# EAGLE schematic 4AC to 3.6DC (0 Cost) (EAGLE 9.6.2)
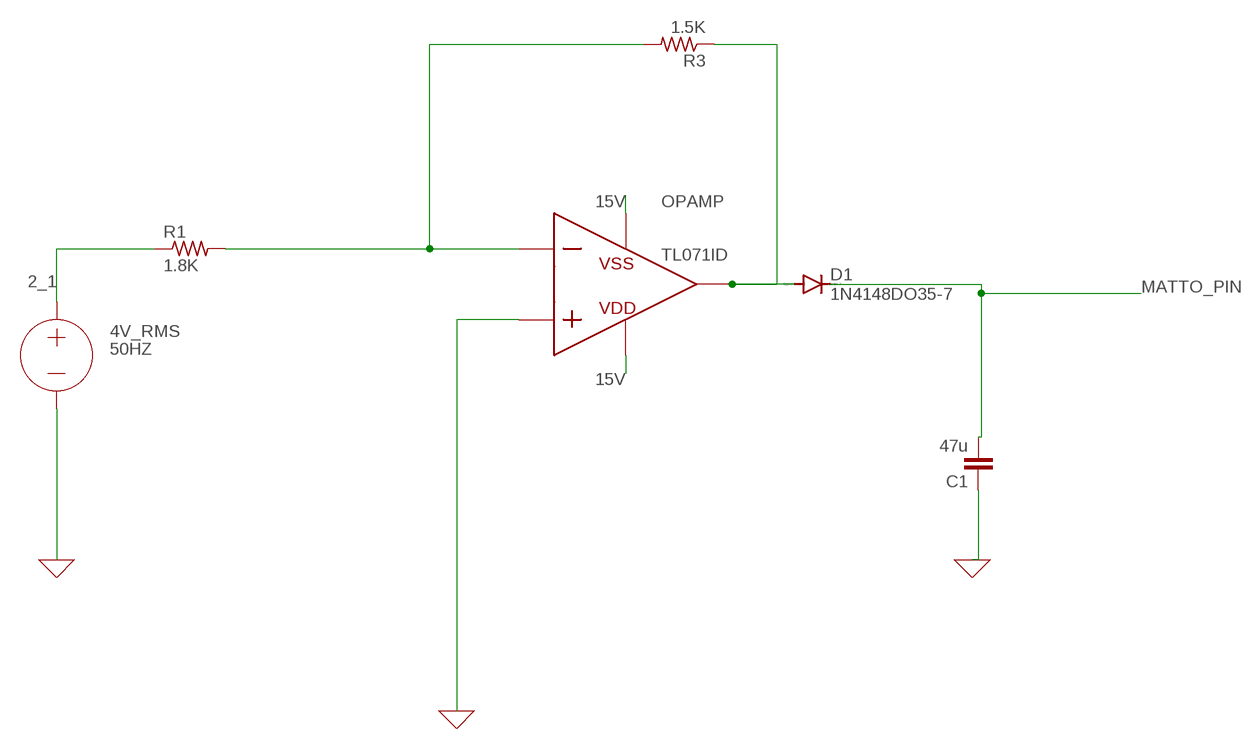
[diagram p0: schematic, sheet 1]

## Parts
4V_RMS  50HZ  VOLTAGE  (no package)
C1  47u  C2.5/2  [C2.5-2]
D1  1N4148DO35-7  [DO35-7]
R1  1.8K  R-US_0204/7  [0204/7]
R3  1.5K  R-US_0204/7  [0204/7]
TL071ID  OPAMP  (no package)

## Nets
0: 4V_RMS.- C1.1 TL071ID.P ; supply symbol labelled GND
2_1: 4V_RMS.+ R1.1
15V: TL071ID.VDD TL071ID.VSS
MATTO_PIN: C1.2 D1.C
N$2: R1.2 R3.2 TL071ID.N
N$3: D1.A R3.1 TL071ID.VOUT

## Library data of the parts
4V_RMS = ngspice-simulation:VOLTAGE: Independent Voltage Source, either DC, AC, PULSE, SINE, PWL, EXP, or SFFM; VALUE: 0V
C1 = capacitor-wima:C: CAPACITOR naming: grid - package width
D1 = diode:1N4148: DIODE high speed (Philips)
R1 R3 = rcl:R-US_: RESISTOR, American symbol; SPICEPREFIX: R
TL071ID = ngspice-simulation:OPAMP: Operational amplifier with power pins